# Altium schematic sheet DSO_Trig.SchDoc: Schematic_Name
size A4; CompanyName: University of Melbourne; Engineer: Your Name Here; DocumentNumber: 1; Revision: 0.1; SheetNumber: 5; SheetTotal: 11; Title_Project: Project_Title; StudentNo: Student No.
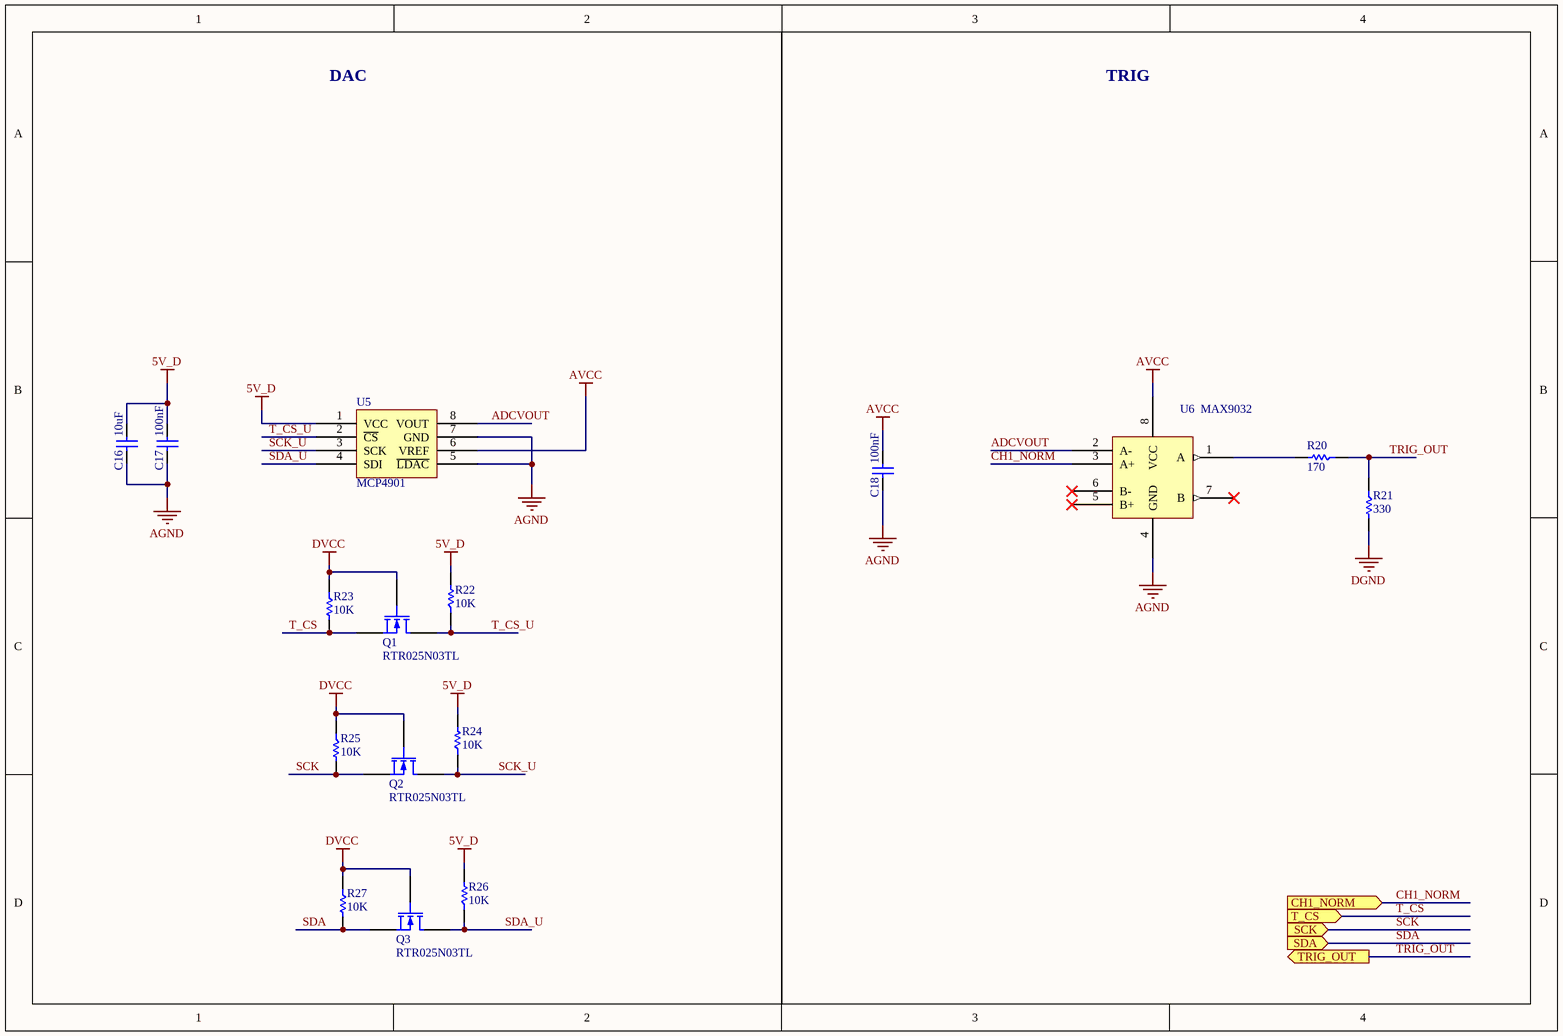
[diagram p0: DSO_Trig.SchDoc]

## Parts
C16  10uF  [0805C]
C17  100nF  [0805C]
C18  100nF  [0805C]
Q1  RTR025N03TL  [SOT23]
Q2  RTR025N03TL  [SOT23]
Q3  RTR025N03TL  [SOT23]
R20  170  [0805]
R21  330  [0805]
R22  10K  [0805]
R23  10K  [0805]
R24  10K  [0805]
R25  10K  [0805]
R26  10K  [0805]
R27  10K  [0805]
U5  MCP4901  [SOIC-8]
U6  MAX9032  [SOIC-8]

## Ports
CH1_NORM (in), SCK (in), SDA (in), T_CS (in), TRIG_OUT (out)

## Nets
5V_D: C16.1 C17.1 R22.2 R24.2 R26.2 U5.1(VCC)
AGND: C16.2 C17.2 C18.2 U5.5(~{LDAC}) U5.7(GND) U6.4(GND)
AVCC: C18.1 U5.6(VREF) U6.8(VCC)
DGND: R21.2
DVCC: Q1.1 Q2.1 Q3.1 R23.1 R25.1 R27.1
ADCVOUT: U5.8(VOUT) U6.2(A-)
CH1_NORM: U6.3(A+) ; port CH1_NORM
SCK: Q2.2 R25.2 ; port SCK
SCK_U: Q2.3 R24.1 U5.3(SCK)
SDA: Q3.2 R27.2 ; port SDA
SDA_U: Q3.3 R26.1 U5.4(SDI)
T_CS: Q1.2 R23.2 ; port T_CS
T_CS_U: Q1.3 R22.1 U5.2(~{CS})
TRIG_OUT: R20.1 R21.1 ; port TRIG_OUT
NetR20_2: R20.2 U6.1(A)

Not connected (* = marked no-connect by the designer): U6 5(B+)* 6(B-)* 7(B)*

## Notes on the sheet
- DAC
- TRIG

## Library data of the parts
C16-C18 = C: Capacitor; Reviewed by: RM - 2018/08/05; Revision: July-2002: Re-released for DXP Platform.; Supplier 1: *; Supplier Part Number 1: *
  C16: Value: 10uF
  C17 C18: Value: 100nF
Q1-Q3 = MOSFET-N: N-Channel MOSFET; PackageDocument: 1995/1996; Published: 8-Jun-2000; LatestRevisionDate: 17-Jul-2002; LatestRevisionNote: Re-released for DXP Platform.; PackageReference: E3; Publisher: Altium Limited
R20-R27 = R: Resistor; Reviewed by: RM - 2018/08/05; Supplier 1: *; Suppler Part Number 1: *
  R20: Value: 170
  R21: Value: 330
  R22-R27: Value: 10K
U5 = MCP4901: DAC 8bit SPI; Reviewed by: RM - 2018/08/05; Supplier 1: Digi-Key; Supplier Part Number 1: MCP4901-E/SN-ND
U6 = MAX9032: Dual Comparator; Reviewed by: RM - 2018/08/05; Supplier 1: Digi-Key; Supplier Part Number 1: MAX9032ASA-ND